# EasyEDA schematic SCH_cam2_2024-05-21.json
TITLE: Sheet_1; REV: 1.0; Date: 2024-05-20; Sheet: 1/1; Drawn By: shwetha0210; Company: Your Company
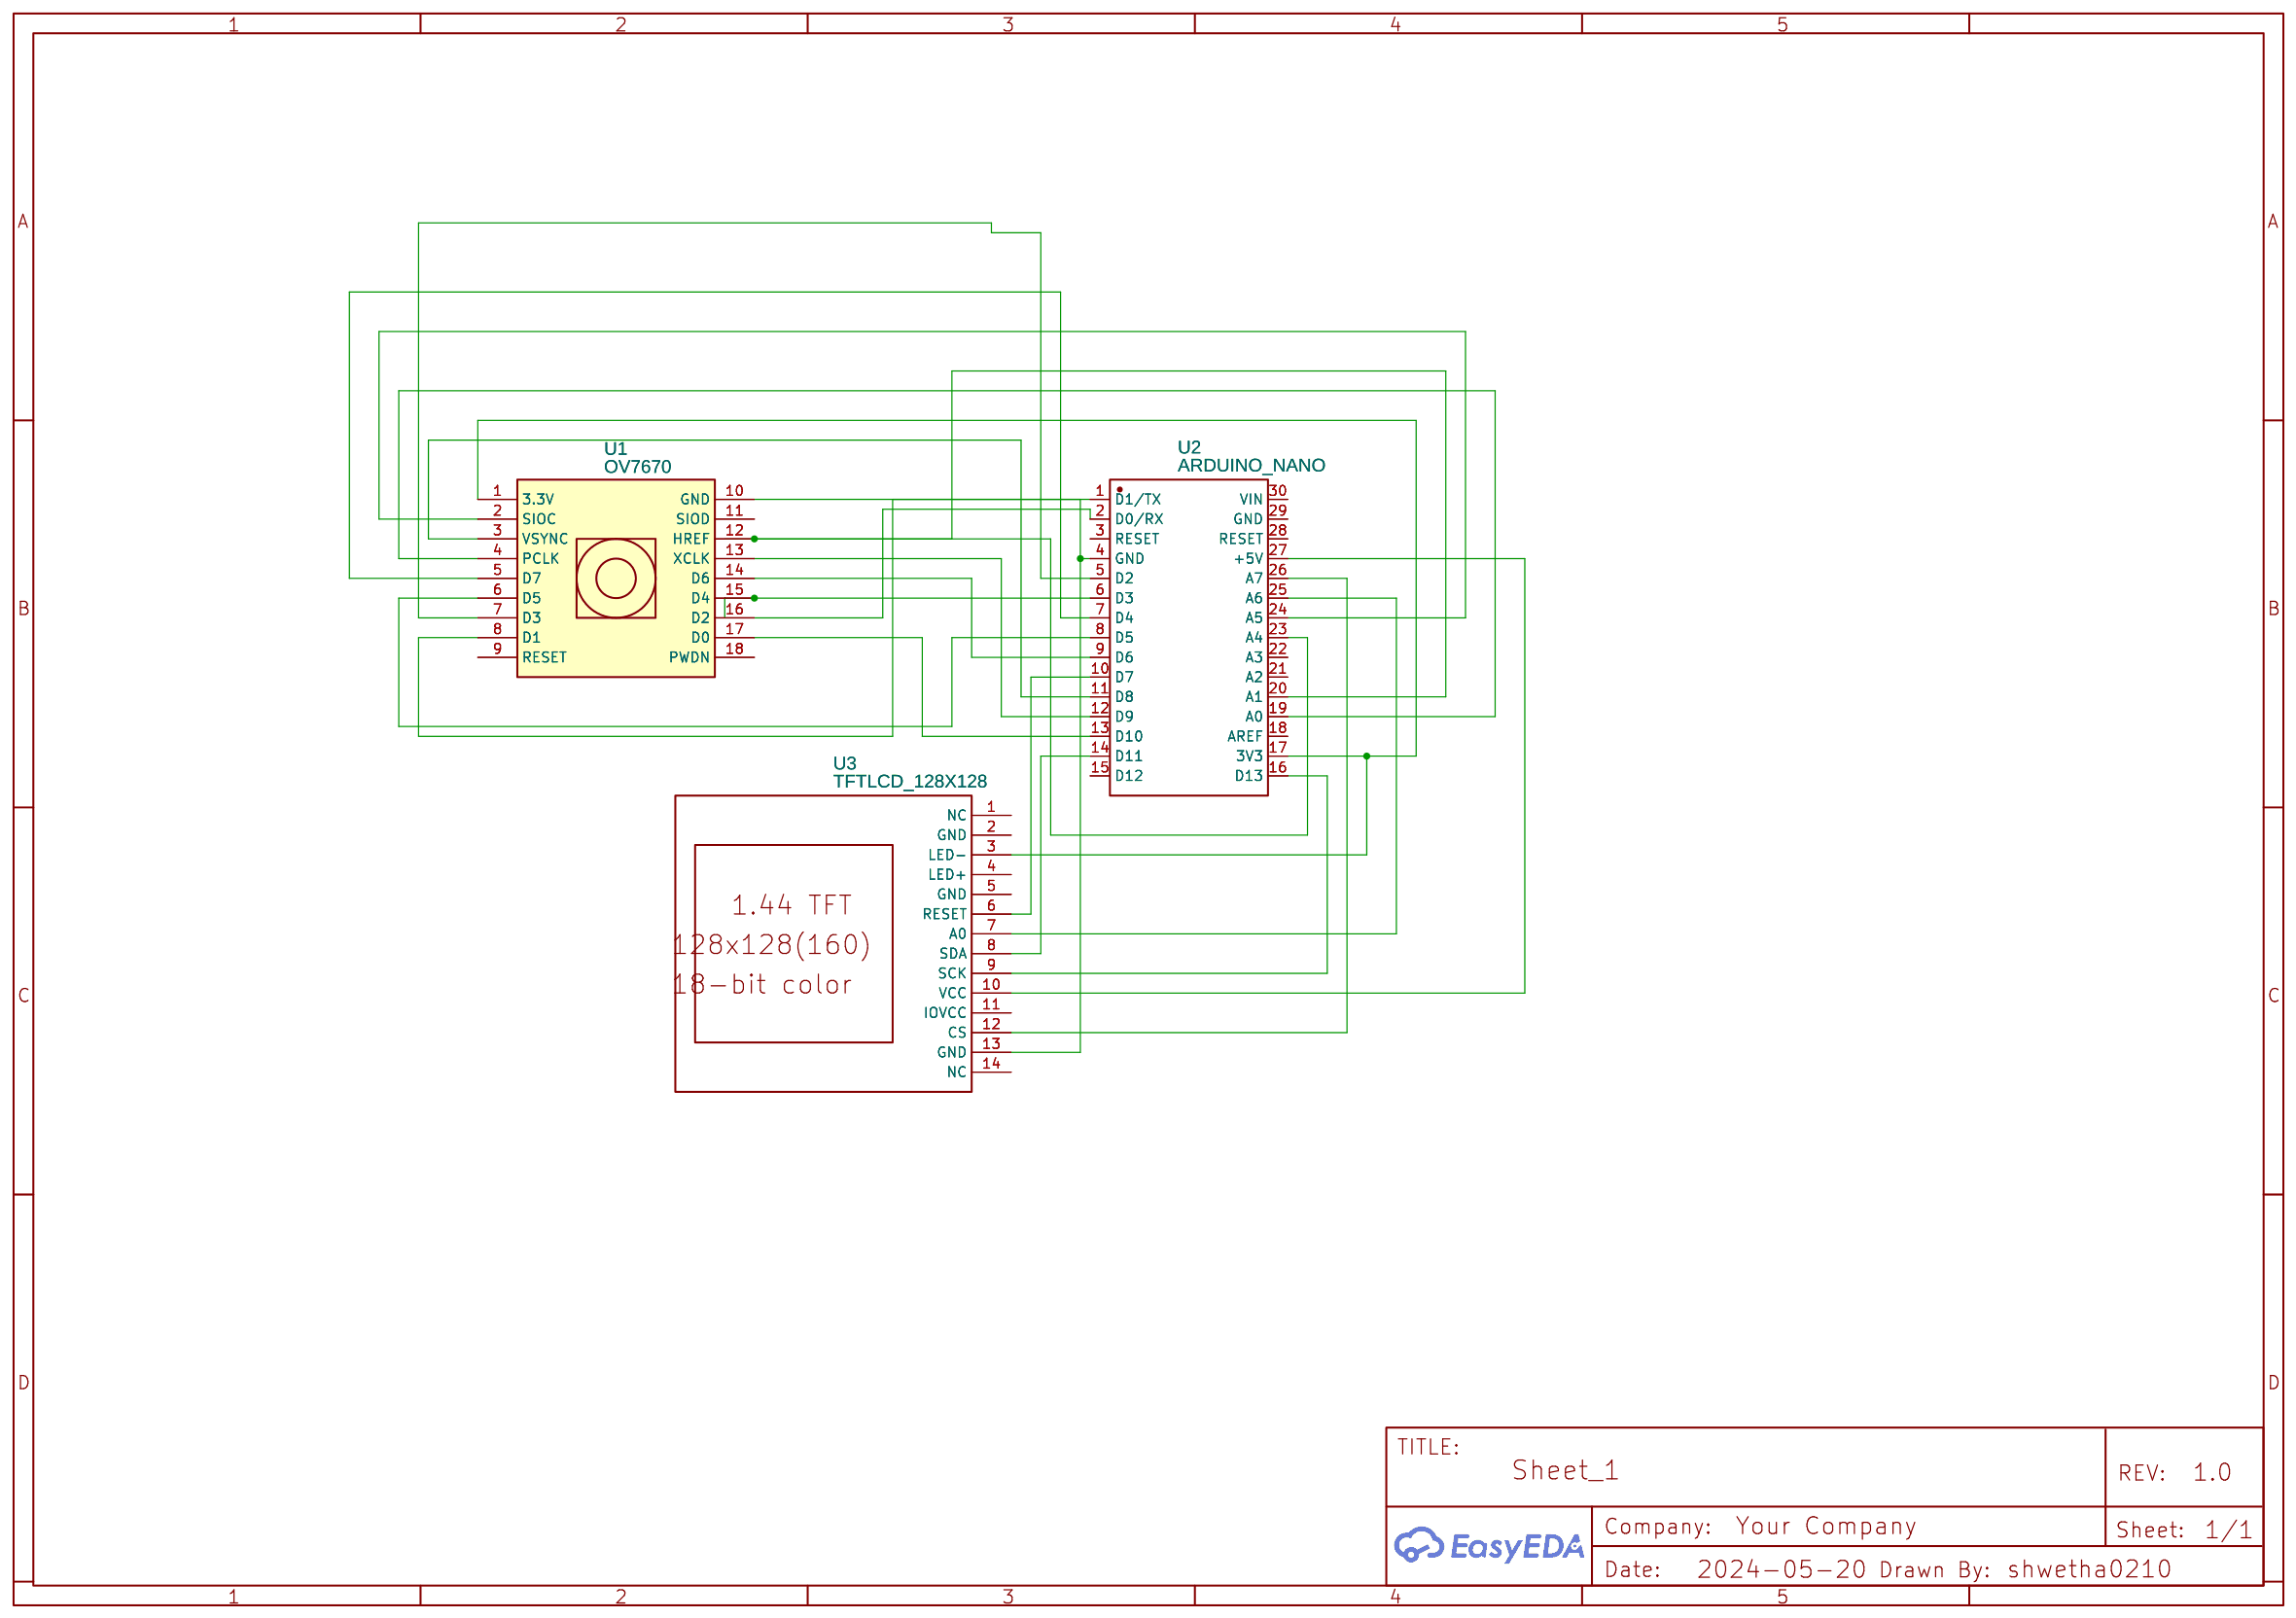
[diagram p0: schematic sheet]

## Parts
U1  OV7670  [OV7670-2X9-PCBLIB]
U2  ARDUINO_NANO  [COMM-TH_ARDUINO_NANO]
U3  TFTLCD_128X128  [TFTLCD_128X128 LONGPADS]

## Library data of the parts
U1 = OV7670: Manufacturer Part: PM254-2-09-Z-8.5; Contributor: 陳詩函; Supplier Part: C2897410; Supplier: LCSC; производитель: HCTL(华灿天禄)
U2 = ARDUINO_NANO: Contributor: lcsc; Supplier: LCSC; Supplier Part: C9900017879; Manufacturer: null; JLCPCB Part Class: Extended Part
U3 = TFTLCD_128X128: Contributor: ibre

## Nets
Net-(U1-1): U1.1(3.3V) U2.17(3V3) U3.3(LED-)
Net-(U1-2): U1.2(SIOC) U2.24(A5)
Net-(U1-3): U1.3(VSYNC) U2.11(D8)
Net-(U1-4): U1.4(PCLK) U2.19(A0)
Net-(U1-5): U1.5(D7) U2.7(D4)
Net-(U1-6): U1.6(D5) U2.8(D5)
Net-(U1-7): U1.7(D3) U2.5(D2)
Net-(U1-8): U1.8(D1) U2.1(D1/TX)
Net-(U1-10): U1.10(GND) U2.4(GND) U3.13(GND)
Net-(U1-12): U1.12(HREF) U2.20(A1) U2.23(A4)
Net-(U1-13): U1.13(XCLK) U2.12(D9)
Net-(U1-14): U1.14(D6) U2.9(D6)
Net-(U1-15): U1.15(D4) U2.6(D3)
Net-(U1-16): U1.16(D2) U2.2(D0/RX)
Net-(U1-17): U1.17(D0) U2.13(D10)
Net-(U2-10): U2.10(D7) U3.6(RESET)
Net-(U2-14): U2.14(D11) U3.8(SDA)
Net-(U2-16): U2.16(D13) U3.9(SCK)
Net-(U2-25): U2.25(A6) U3.7(A0)
Net-(U2-26): U2.26(A7) U3.12(CS)
Net-(U2-27): U2.27(+5V) U3.10(VCC)

Not connected (* = marked no-connect by the designer): U1 9(RESET) 11(SIOD) 18(PWDN); U2 3(RESET) 15(D12) 18(AREF) 21(A2) 22(A3) 28(RESET) 29(GND) 30(VIN); U3 1(NC) 2(GND) 4(LED+) 5(GND) 11(IOVCC) 14(NC)
